# EAGLE design gemma-stm32 (EAGLE 6.5.0)
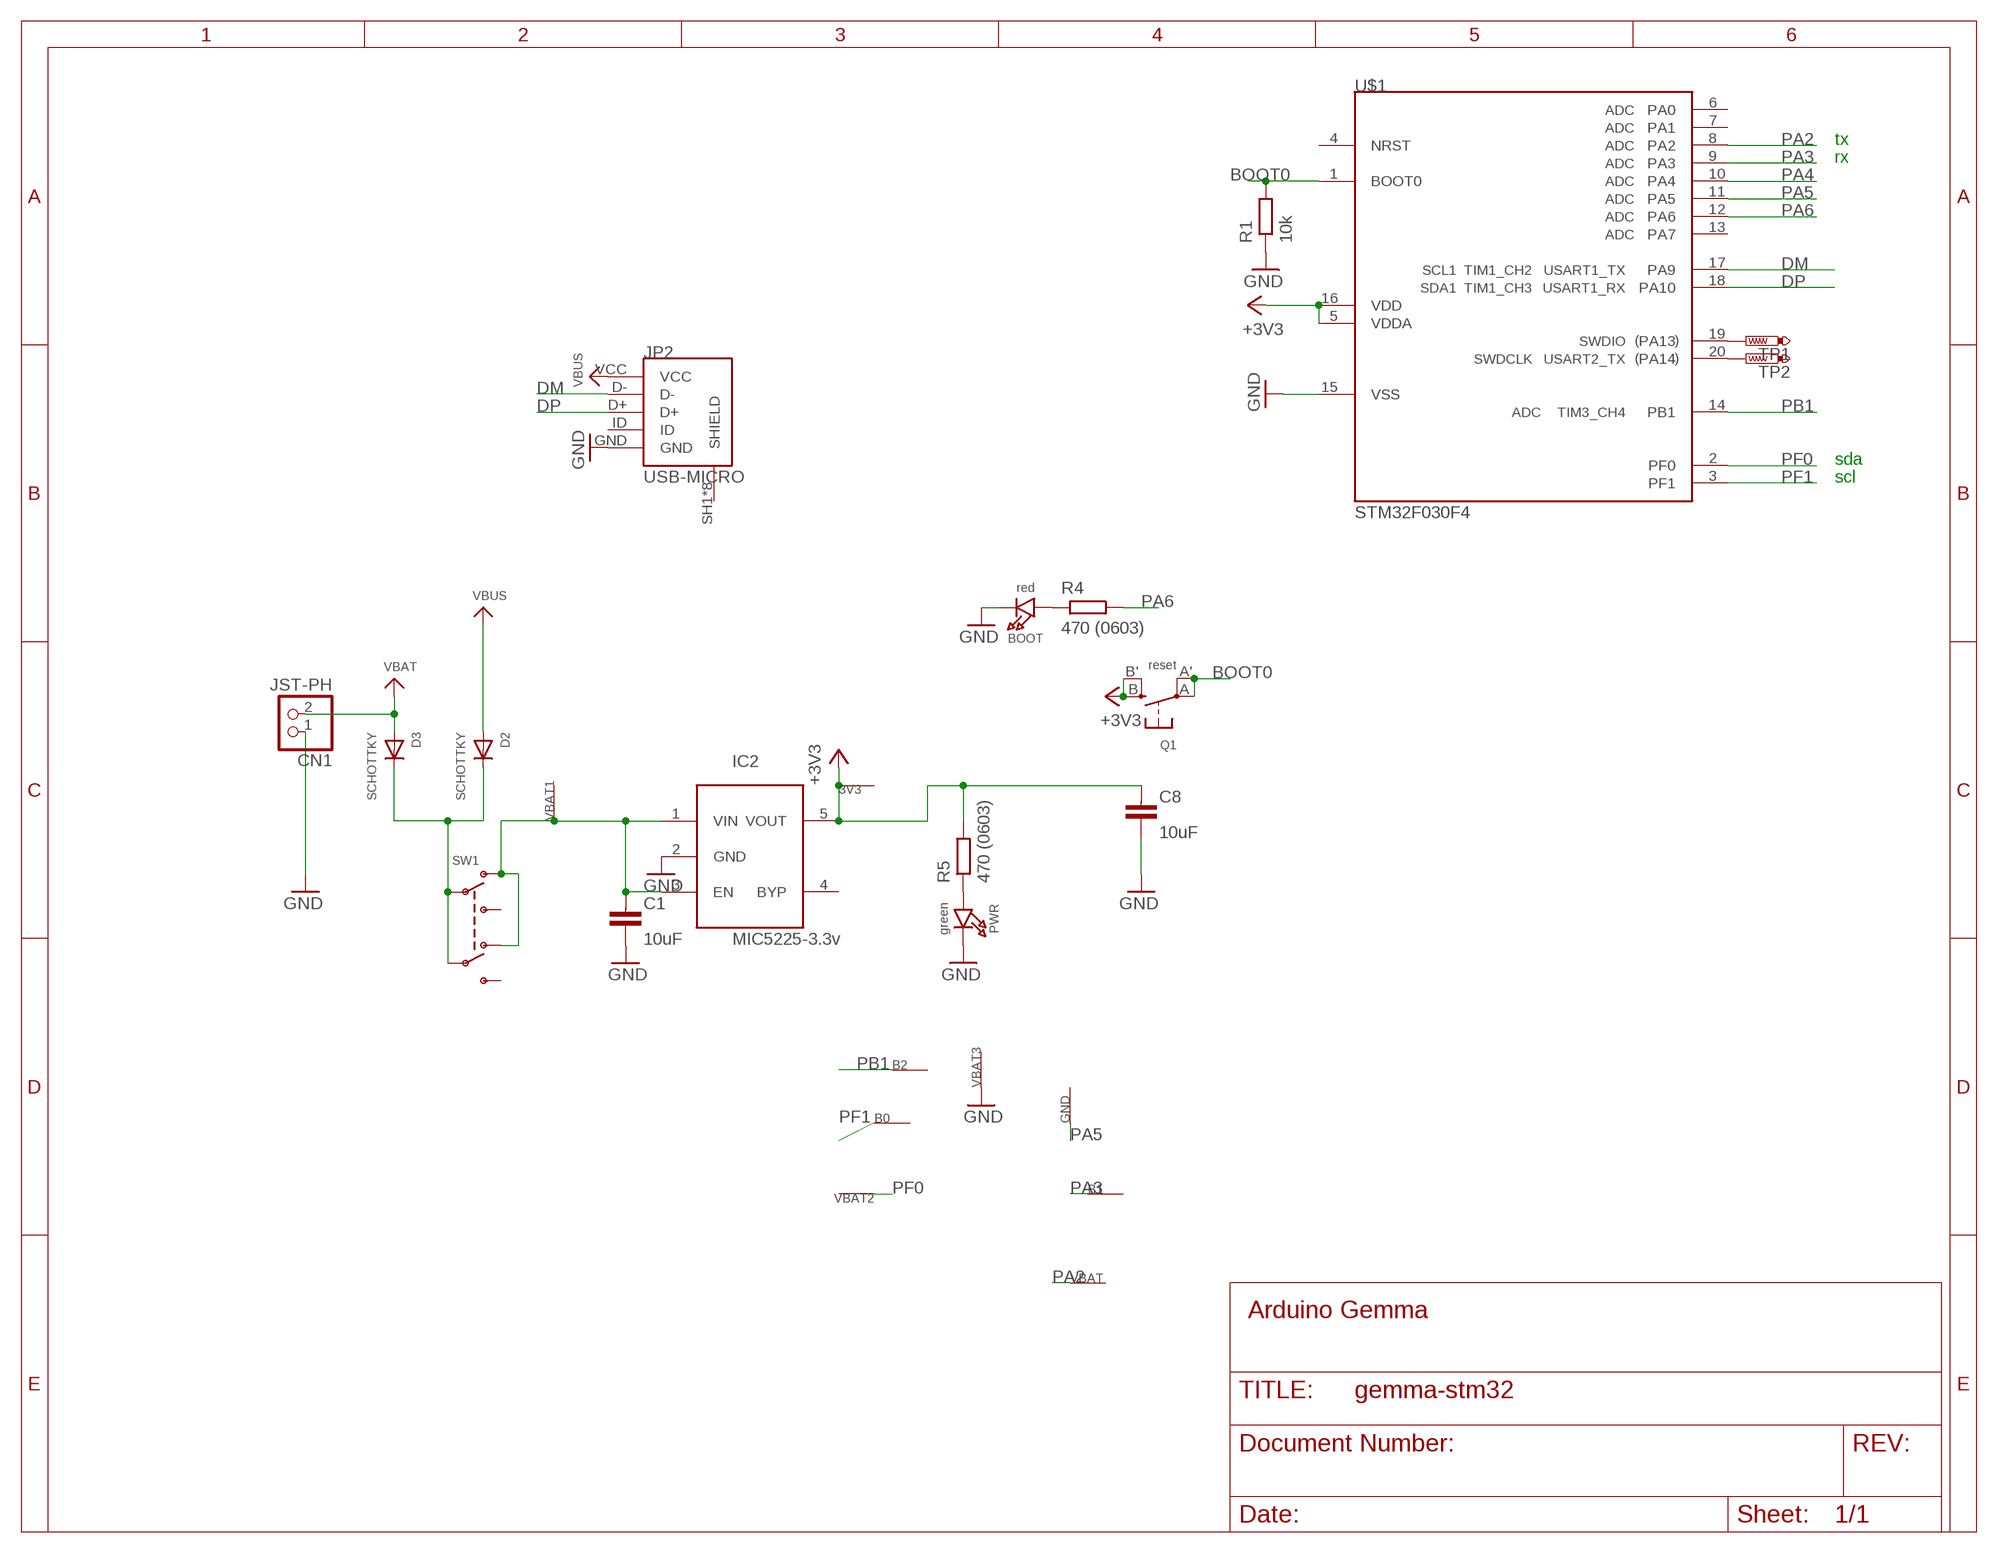
[diagram p0: schematic, sheet 1]

## Parts
3V3  SEWTAP-2.0IN  [SEWINGTAP_2.0]
B0  SEWTAP-2.0IN  [SEWINGTAP_2.0]
B1  SEWTAP-2.0IN  [SEWINGTAP_2.0]
B2  SEWTAP2.0-L  [SEWINGTAP_2.0_NARROW_L]
BOOT  red  LED0805_NOOUTLINE  [CHIPLED_0805_NOOUTLINE]
C1  10uF  CAPACITOR0603-L  [C0603-L]
C8  10uF  CAPACITOR0603-L  [C0603-L]
CN1  JST-PH  CON_JST_PH_2PIN  [JSTPH2]
D2  SCHOTTKY  DIODE_SOD-123FL  [SOD-123FL]
D3  SCHOTTKY  DIODE_SOD-123FL  [SOD-123FL]
GND  SEWTAP-2.0IN  [SEWINGTAP_2.0]
IC2  MIC5225-3.3v  LP298XS  [SOT23-5L]
JP2  USB-MICRO  [MOLEX_47589-0001]
PWR  green  LED0805_NOOUTLINE  [CHIPLED_0805_NOOUTLINE]
Q1  reset  SWITCH_TACT_SMT4.6X2.8  [BTN_KMR2_4.6X2.8]
R1  10k  RESISTOR0603-L  [R0603-L]
R4  470 (0603)  RESISTOR0603-L  [R0603-L]
R5  470 (0603)  RESISTOR0603-L  [R0603-L]
SW1  SWITCH_DPDTEG1390  [EG1390]
TP1  PTR1TP08R  [TP08R]
TP2  PTR1TP08R  [TP08R]
U$1  STM32F030F4  [TSSOP20]
VBAT  SEWTAP-2.0IN  [SEWINGTAP_2.0]
VBAT1  SEWTAP  [SEWINGTAP_2.0_ONESIDE]
VBAT2  SEWTAP-2.0IN  [SEWINGTAP_2.0]
VBAT3  SEWTAP2.0-R  [SEWINGTAP_2.0_NARROW_R]

## Nets
+3V3: 3V3.P$1(SEW) C8.1 IC2.5(VOUT) Q1.B'(S1) Q1.B(S) R5.2 U$1.5(VDDA) U$1.16(VDD)
BOOT0: Q1.A'(P1) Q1.A(P) R1.2 U$1.1(BOOT0)
DM: JP2.D- U$1.17(PA9)
DP: JP2.D+ U$1.18(PA10)
GND: BOOT.C C1.2 C8.2 CN1.1 IC2.2(GND) JP2.GND PWR.C R1.1 U$1.15(VSS) VBAT3.P$1(SEW)
N$2: TP1.TP U$1.19(PA13)
N$5: TP2.TP U$1.20(PA14)
N$6: BOOT.A R4.1
N$7: C1.1 IC2.1(VIN) IC2.3(EN) SW1.O1 SW1.O2 VBAT1.P$1(SEW)
N$8: PWR.A R5.1
N$9: D2.C D3.C SW1.P1 SW1.P2
PA2: U$1.8(PA2) VBAT.P$1(SEW)
PA3: B1.P$1(SEW) U$1.9(PA3)
PA4: U$1.10(PA4)
PA5: GND.P$1(SEW) U$1.11(PA5)
PA6: R4.2 U$1.12(PA6)
PB1: B2.P$1(SEW) U$1.14(PB1)
PF0: U$1.2(PF0) VBAT2.P$1(SEW)
PF1: B0.P$1(SEW) U$1.3(PF1)
VBAT: CN1.2 D3.A
VBUS: D2.A JP2.VCC
Unconnected: IC2.4(BYP) JP2.ID JP2.SH1(SHIELD) JP2.SH2(SHIELD) JP2.SH3(SHIELD) JP2.SH4(SHIELD) JP2.SH5(SHIELD) JP2.SH6(SHIELD) JP2.SH7(SHIELD) JP2.SH8(SHIELD) SW1.S1 SW1.S2 U$1.4(NRST) U$1.6(PA0) U$1.7(PA1) U$1.13(PA7)

## Notes on the sheet
- tx
- rx
- sda
- scl
- Arduino Gemma

## Library data of the parts
3V3 B0 B1 GND VBAT VBAT2 = adafruit:SEWTAP
B2 VBAT1 VBAT3 = pads:SEWTAP
BOOT PWR = microbuilder:LED: LED 0603 - 0603 Surface Mount Package 2mA: Green LED - Low Power (3.9mcd, 2ma, 1.7Vf) - Digikey: 475-2709-2-ND Orange LED - Low Power (9.8mcd, 2ma, 1.8Vf) - Digikey: 475-1194-2-ND Red LED - Low Power (5mcd, 2ma, 1.8Vf) - Digikey: 475-1195-2-ND Yellow LED - Low Power (7mcd, 2ma, 1.8Vf) - Digikey: 475-1196-2-ND 5mA: Blue LED - Low Power (17mcd, 5ma, 2.9Vf) - Digikey: LNJ937W8CRACT-ND 0805 - 0805 Surface Mount Package 2mA: Red LED (8.8mcd, 2mA, 1.8Vf, Clear) - Low Power [Digikey: 475-2510-1-ND] Green LED (5mcd, 2mA, 1.8Vf, Clear) - Low Power [Digikey: 475-2730-1-ND] Yellow LED (11.3mcd, 2mA, 1.8Vf, Clear) - Low Power [Digikey: 475-2555-1-ND] 20mA: Red LED (104mcd, 20mA, Diffused) - LS R976 [Digikey: 475-1278-6-ND] Red LED (12mcd, 20mA, 2.0Vf, Clear) - APT2012EC [Digikey: 754-1128-1-ND] Green LED (15mcd, 20mA, 2.2Vf, Clear) - APT2012GC [Digikey: 754-1131-1-ND] Orange LED (160mcd, 20mA, 2.1Vf, Clear) - APT2012SECK [Digikey: 754-1130-1-ND] 1206 - 1206 Surface Mount Package Green LED (26mcd, 20mA, Diffused) - LG N971 [Digikey: 475-1407-6-ND] Red LED (15mcd, 20mA, Diffused) - LH N974 [Digikey: 475-1416-6-ND] Cree - Cree High-Power Surface Mount LEDs XPEBWT-L1-0000-00D50 - White 111lm 350mA 2.9Vf 6200K 110° XTEAWT-00-0000-00000LEE3 - White 114lm 350mA 2.85Vf 5000K 115° Everlight - Everlight 45-21 Series Surface Mount LEDs 45-21/QK2C-B2832AC2CB2/2T - Warm White 2000mcd 20mA 3.25Vf 3050K 120° 45-21/LK2C-B38452C4CB2/2T - Nuetral White 2000mcd 20mA 3.25Vf 4150K 120° 45-21/LK2C-B50634C6CB2/2T - Cold White 2200mcd 20mA 3.25Vf 5650K 120° PLCC2 Reverse Mount LS T77K-J1L2-1-0-2-R18-Z - Red 11.25mcd 2mA 1.8Vf 630nm 120° LO T77K-L1M2-24-Z - Orange 19.6mcd 2mA 1.8Vf 606nm 120° LY T77K-K2M1-26-Z - Yellow 15.7mcd 2mA 1.8Vf 587nm 120°
C1 C8 = passives-7351:CAPACITOR
CN1 = microbuilder:CON_JST_PH_2PIN: JST 2-Pin Right-Angle Connector PH-Series - 4UConnector: 17311 SH-Series - 4UConnector: 07278
D2 D3 = adafruit:DIODE: Diode SMADIODE - SMA Surface Mount Package 20V 1A Schottky Diode Digikey: 641-1014-6-ND DO-1N4148 - Through Hole Small Current Diode SOD-123 20V 1 A (.5mV Vf) Schottky Diode - Digikey: MBRX120TPMSCT-ND SOD-323 10V 570mA (.38mV Vf, 3ns) Schottky Diode - Digikey: ZLLS410CT-ND SOD-523 30V 30mA Schottky Diode (RB751S-40TE61) - Digikey: RB751S-40TE61CT-ND SOT23-R/W - SOT23 Package (R = Solder Paste/Reflow Ovens, W = Hand-Soldering) BAT54Film 40V 300mA - Digikey: 497-7162-1-ND
IC2 = adafruit:LP298X
JP2 = Mine:USB-MICRO
Q1 = microbuilder:SWITCH_TACT_SMT: SMT Tact Switches 6x6mm - Digikey: P12940SCT-ND KMR2 (4.6x2.8mm) - Digikey: 401-1426-1-ND EVQ-PQHB55 - Light Touch, 160GF (4.5x4.5mm) - Digikey: P8090SCT-ND KMT0 - KMT021 NGJ LHS (etc.) IP68/Waterproof - Digikey: CKN10289CT-ND
R1 R4 R5 = passives-7351:RESISTOR
SW1 = microbuilder:SWITCH_DPDT: Switch - DPDT A DPDT Switch acts like an SPDT switch, but has a pair of switches instead of just one. Vertical - 0.3A @ 6V SMT - Digikey: JS202011SCQN
TP1 TP2 = testpad:PTR1: TEST PIN
U$1 = dtb:STM32F030F4

## Board
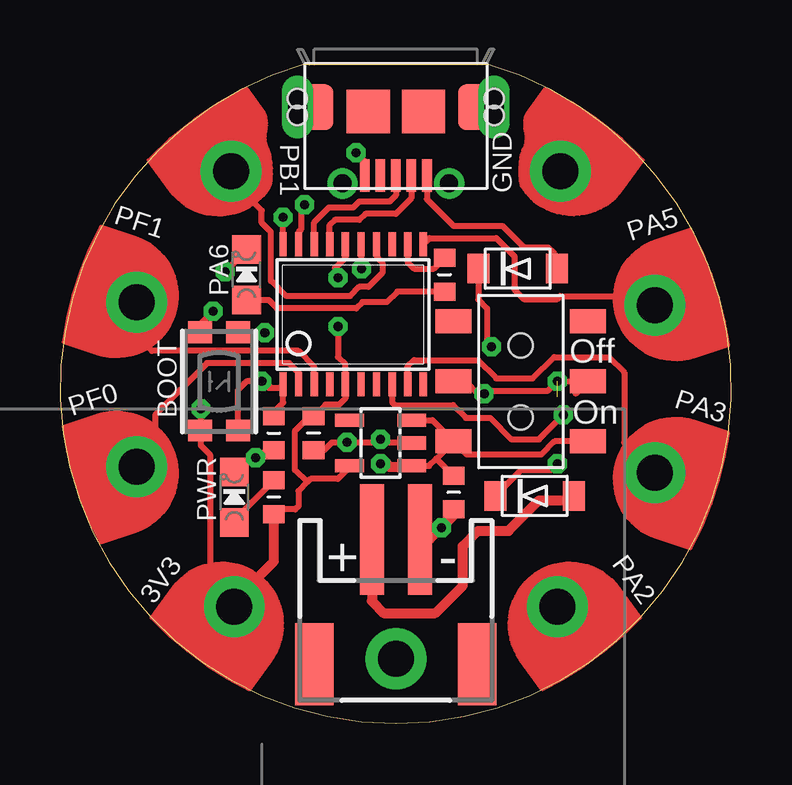
[diagram p1: board, top side]
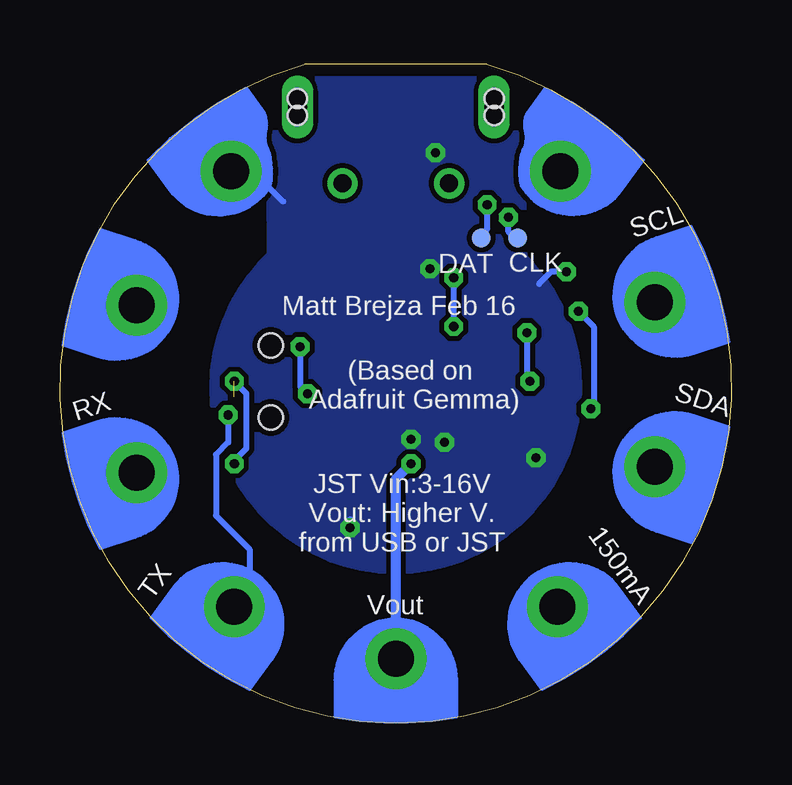
[diagram p2: board, bottom side, seen from below]

Size 27.97 x 27.46 mm. Coordinates in mm from the lower left corner, seen from the top.
Outline: 10.17,27.46 17.79,27.46 arc-328 10.17,27.46
Copper layers (1*16): Top 0.035mm / dielectric 1.5mm / Bottom 0.035mm
Design rules "adafruit *": minimum track width 8mil, minimum drill 14.5mil, track to track 8mil, track to pad 8mil, pad to pad 8mil, via to via 8mil, smd to smd 0mil, copper to edge 10mil, drill to drill 8mil, minimum pad ring 10mil, minimum via ring 8mil, stop-mask expansion 2mil, vias tented up to drill 20mil, thermal gap 10mil

### Footprints (pad centres in the part's own frame; a part is rotated, then mirrored left to right if it is on the bottom)
SEWINGTAP_2.0 = drill 1.5 pad 2.54: P$1 0,0
SEWINGTAP_2.0_NARROW_L = drill 1.5 pad 2.54: P$1 0,0
CHIPLED_0805_NOOUTLINE = smd 1.2 x 1.2: A 0,-1.05; C 0,1.05
C0603-L = smd 0.75 x 0.9: 1 -0.7,0; 2 0.7,0
JSTPH2 = smd 1 x 4.6: 1 -1,-3.7; 2 1,-3.7 | smd 1.6 x 3.4: NC1 -3.4,1.5; NC2 3.4,1.5
SOD-123FL = smd 0.91 x 1.22: A 1.637,0; C -1.637,0
SOT23-5L = smd 0.55 x 1.2: 1 -0.95,-1.3; 2 0,-1.3; 3 0.95,-1.3; 4 0.95,1.3; 5 -0.95,1.3
MOLEX_47589-0001 = smd 1.35 x 0.4: D+ 2.855,0; D- 2.855,0.652; GND 2.855,-1.3; ID 2.855,-0.65; VCC 2.855,1.3 | smd 1.8 x 1.8: SH1 0.18,1.15; SH2 0.18,-1.15 | drill 0.75 pad 1.15: SH3 3.18,-2.225; SH4 3.18,2.225 | smd 1.9 x 2.1: SH5 0,3.65; SH6 0,-3.65 | drill 0.8 pad 1.2 long: SH7 0,-4.1; SH8 0,4.1 | hole 0.8: -0.35,-4.1; 0.35,-4.1; -0.35,4.1; 0.35,4.1
BTN_KMR2_4.6X2.8 = smd 0.9 x 1: A 2.05,0.8; A' -2.05,0.8; B 2.05,-0.8; B' -2.05,-0.8
R0603-L = smd 0.75 x 0.9: 1 -0.7,0; 2 0.7,0
EG1390 = smd 1 x 1.5: O1 -2.5,2.8; O2 -2.5,-2.8; P1 0,2.8; P2 0,-2.8; S1 2.5,2.8; S2 2.5,-2.8 | hole 1: 1.5,0; -1.5,0
TP08R = smd 0.8 x 0.8: TP 0,0
TSSOP20 = smd 0.305 x 0.991: 1 -2.925,-2.918; 2 -2.275,-2.918; 3 -1.625,-2.918; 4 -0.975,-2.918; 5 -0.325,-2.918; 6 0.325,-2.918; 7 0.975,-2.918; 8 1.625,-2.918; 9 2.275,-2.918; 10 2.925,-2.918; 11 2.925,2.918; 12 2.275,2.918; 13 1.625,2.918; 14 0.975,2.918; 15 0.325,2.918; 16 -0.325,2.918; 17 -0.975,2.918; 18 -1.625,2.918; 19 -2.275,2.918; 20 -2.925,2.918
SEWINGTAP_2.0_ONESIDE = drill 1.5 pad 2.54: P$1 0,0
SEWINGTAP_2.0_NARROW_R = drill 1.5 pad 2.54: P$1 0,0

### Placement (x,y rotation side)
3V3  7.25,4.85 144 top
B0  3.19,17.55 72 top
B1  24.78,10.44 252 top
B2  7.13,23.01 36 top
BOOT  7.76,18.69 0 top
C1  16.4,9.62 270 top
C8  10.56,12.09 270 top
CN1  13.98,3.96 180 top
D2  19.06,18.95 0 top
D3  19.77,9.48 0 top
GND  24.78,17.42 288 top
IC2  13.35,11.68 90 top
JP2  13.98,25.68 270 top
PWR  7.25,9.42 0 top
Q1  6.62,14.25 270 top
R1  8.9,12.09 90 top
R4  16.02,18.69 90 top
R5  8.9,9.42 270 top
SW1  19.19,14.25 90 top
TP1  10.43,20.22 0 bottom
TP2  8.9,20.22 0 bottom
U$1  12.21,17.04 0 top
VBAT  20.72,4.85 216 top
VBAT1  13.98,2.69 180 bottom
VBAT2  3.19,10.69 108 top
VBAT3  20.84,23.01 324 top

### Tracks (layer width: path | path; a pad name or v marks a point on that pad's centre or on a via)
+3V3  (via drill 0.38)
  Top 0.254: U$1.16 11.88,19.41 11.44,18.97 11.44,18.69 v11.57,18.57 | Q1.B' 5.82,16.62 v6.36,17.17 | v5.86,13.11 5.86,12.24 | 5.86,12.24 Q1.B | v11.57,16.54 11.57,15.27 11.88,14.96 U$1.5 11.88,13.54 11.62,13.28 11.05,13.28 C8.1 | IC2.5 12.05,10.66 11.57,10.19 10.43,10.19 10.3,10.06 | 10.3,10.06 9.92,9.68 9.92,9.04 9.79,8.92 9.1,8.92 R5.2 | C8.1 10.37,12.79 | 5.86,12.24 5.86,11.58 6.24,11.2 6.24,5.87 3V3.P$1 | C8.1 10.39,12.79 9.77,12.17 9.77,10.57 10.28,10.06 10.3,10.06 | 9.15,8.85 9.09,8.85 8.9,8.66
  Top 0.406: 3V3.P$1 7.25,5.11 8.9,6.76 8.9,8.66 R5.2
  Bottom 0.254: v6.36,17.17 5.73,16.54 5.73,13.23 v5.86,13.11 | v11.57,18.57 v11.57,16.54
BOOT0  (via drill 0.38)
  Top 0.254: v8.4,14.25 8.65,14 8.78,14 | 8.78,14 9.15,14 U$1.1 9.29,13.36 8.9,12.98 R1.2 | Q1.A 7.42,13.91 7.76,14.25 v8.4,14.25 | Q1.A' 8.51,16.3 v8.52,16.28 | v8.4,14.25 8.52,14.25 8.78,14
  Bottom 0.254: v8.52,16.28 8.52,14.38 v8.4,14.25
DM
  Top 0.254: JP2.D- 14.64,21.89 13.98,21.23 12.71,21.23 12.46,20.98 11.44,20.98 11.23,20.77 U$1.17
DP
  Top 0.254: JP2.D+ 13.98,22 13.73,21.74 12.46,21.74 12.21,21.49 11.19,21.49 10.58,20.88 U$1.18
GND  (via drill 0.38)
  Top 0.254: 13.37,11.81 v13.35,11.84 | IC2.2 13.5,11.68 v13.35,11.84 | C8.2 11,11.39 11.32,11.71 13.22,11.71 v13.35,11.84 | PWR.C 7.29,10.47 7.89,11.07 v8.14,11.07 8.27,11.07 8.59,11.39 R1.1 8.72,11.2 | BOOT.C 7.54,19.74 7.54,19.49 v6.87,18.82 | JP2.GND 12.68,23.42 v12.33,23.77 | U$1.15 12.53,18.98 v12.56,18.95
  Top 0.406: CN1.1 15.4,7.66 v15.89,8.15 16.4,8.66 C1.2
  Bottom 0.254: v13.35,11.84 13.35,12.09 | v12.33,23.77 12.08,23.77 | VBAT3.P$1 19.95,23.01 18.68,21.74 | v8.14,11.07 8.02,10.95 | v6.87,18.82 7.51,18.82 8.02,18.31
  Bottom 0.406: v15.89,8.15 15.89,8.41
  other vias: 11.95,11.71
  pour Bottom: 6.36,14 arc90 13.98,6.38 arc90 21.6,14 arc90 13.98,21.62 arc90
  pour Bottom: 8.78,26.82 8.65,18.95 19.19,18.95 19.32,26.82
N$2  (via drill 0.38)
  Top 0.254: U$1.19 9.93,20.48 10.05,20.6 10.05,21.49 v10.17,21.62
  Bottom 0.254: v10.17,21.62 9.92,21.62 10.17,21.36 10.17,20.6 10.43,20.35 TP1.TP
N$5  (via drill 0.38)
  Top 0.254: U$1.20 v9.29,21.08
  Bottom 0.254: TP2.TP 9.02,20.22 9.29,20.48 v9.29,21.08
N$6
  Top 0.254: R4.1 14.05,17.99 13.6,17.55 12.59,17.55 12.33,17.3 9.03,17.3 8.68,17.64 BOOT.A
N$7  (via drill 0.38)
  Top 0.254: 15.68,11.03 15.38,10.73 IC2.1 | 15.68,11.03 SW1.O1 | C1.1 15.68,11.03 | IC2.3 15.51,12.63 SW1.O1 | SW1.O2 20.6,11.75 20.06,11.2 16.94,11.2 SW1.O1
  Top 0.406: v13.35,10.82 13.6,10.82 13.73,10.69 14.61,10.69 IC2.1
  Bottom 0.406: VBAT1.P$1 13.98,10.19 v13.35,10.82
N$8
  Top 0.254: PWR.A 7.25,8.47 R5.1
N$9  (via drill 0.38)  (1 unrouted)
  Top 0.254: SW1.P1 16.91,14.25 17.41,13.74 v17.67,13.74 17.79,13.87 20.33,13.87 v20.72,14.25 SW1.P2 21.48,13.74 | v20.72,10.82 20.46,10.57 19.22,10.57 D3.C | D2.C 17.43,17.67 17.79,17.3 17.79,15.9 17.97,15.72 v17.97,15.7
  Bottom 0.254: v20.72,10.82 20.72,10.95 20.21,11.46 20.21,13.74 v20.72,14.25 | v17.97,15.7 17.97,14.05 v17.67,13.74
PA2  (via drill 0.38)
  Top 0.254: U$1.8 13.83,13.39 13.96,13.26 16.37,13.26 16.91,12.73 17.92,12.73 18.81,11.84 19.95,11.84 v20.97,12.85
  Bottom 0.254: v20.97,12.85 20.97,11.71 21.48,11.2 21.48,8.66 20.08,7.26 20.08,5.49 VBAT.P$1
PA3
  Top 0.254: U$1.9 14.48,14.87 14.75,15.14 17.41,15.14 18.18,14.38 19.7,14.38 20.59,15.27 22.87,15.27 23.51,14.63 23.51,11.71 B1.P$1
PA5
  Top 0.254: GND.P$1 24.4,17.81 20.84,17.81 20.72,17.68 19.32,17.68 18.94,18.06 18.94,19.46 18.18,20.22 15.39,20.22 U$1.11
PA6
  Top 0.254: U$1.12 14.48,19.21 14.75,18.95 15.57,18.95 R4.2
PB1
  Top 0.254: B2.P$1 7.51,22.63 7.51,22.25 8.4,21.36 8.4,20.85 8.78,20.47 8.78,18.44 9.41,17.81 12.08,17.81 12.46,18.19 12.84,18.19 13.43,18.77 13.43,19.2 13.18,19.45 U$1.14
PF0
  Top 0.254: U$1.2 9.93,14.62 9.54,15.01 6.11,15.01 3.95,12.85 3.95,12.34 3.19,11.58 VBAT2.P$1
PF1
  Top 0.254: U$1.3 10.58,14.86 9.92,15.52 3.82,15.52 3.19,16.15 B0.P$1
VBAT
  Top 0.406: CN1.2 12.98,5.09 13.48,4.6 15.64,4.6 16.78,5.74 16.78,7.39 17.41,8.03 18.68,8.03 19.95,9.3 21.23,9.3 D3.A
VBUS
  Top 0.254: JP2.VCC 15.28,21.84 16.4,20.73 18.43,20.73 19.32,19.84 20.33,19.84 20.59,19.58 20.59,19.06 D2.A

### Text on the board
tPlace: PB1 | GND | PF1 | PA5 | PA6 | Off | PF0 | BOOT | PA3 | On | PWR | PA2 | + | - | 3V3
bPlace: SCL | CLK | DAT | Matt Brejza Feb 16 | (Based on / Adafruit Gemma) | SDA | RX | JST Vin:3-16V / Vout: Higher V. / from USB or JST | 150mA | Vout | TX
tDocu: SCL/SCK | GND | SDA/MOSI | MISO | 3-16VDC